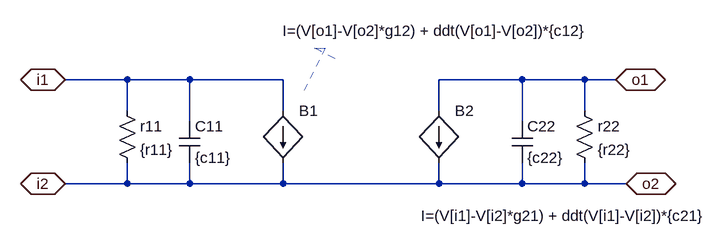
[diagram p0: schematic model_y.asc]
model_y.asc, the LTspice schematic file:
Version 4
SHEET 1 1028 680
WIRE -16 64 -112 64
WIRE 80 64 -16 64
WIRE 224 64 80 64
WIRE 592 64 464 64
WIRE 688 64 592 64
WIRE 736 64 688 64
WIRE -16 112 -16 64
WIRE 224 112 224 64
WIRE 464 112 464 64
WIRE 688 112 688 64
WIRE 80 128 80 64
WIRE 592 128 592 64
WIRE -16 224 -16 192
WIRE -16 224 -112 224
WIRE 80 224 80 192
WIRE 80 224 -16 224
WIRE 224 224 224 192
WIRE 224 224 80 224
WIRE 464 224 464 192
WIRE 464 224 224 224
WIRE 592 224 592 192
WIRE 592 224 464 224
WIRE 688 224 688 192
WIRE 688 224 592 224
WIRE 752 224 688 224
FLAG -112 64 i1
IOPIN -112 64 BiDir
FLAG -112 224 i2
IOPIN -112 224 BiDir
FLAG 736 64 o1
IOPIN 736 64 BiDir
FLAG 752 224 o2
IOPIN 752 224 BiDir
SYMBOL res -32 96 R0
SYMATTR InstName r11
SYMATTR Value {r11}
SYMBOL cap 64 128 R0
SYMATTR InstName C11
SYMATTR Value {c11}
SYMBOL res 672 96 R0
SYMATTR InstName r22
SYMATTR Value {r22}
SYMBOL cap 576 128 R0
SYMATTR InstName C22
SYMATTR Value {c22}
SYMBOL bi 224 112 R0
WINDOW 3 -1 -123 Left 2
SYMATTR InstName B1
SYMATTR Value I=(V[o1]-V[o2]*g12) + ddt(V[o1]-V[o2])*{c12}
SYMBOL bi 464 112 R0
WINDOW 3 -28 161 Left 2
SYMATTR InstName B2
SYMATTR Value I=(V[i1]-V[i2]*g21) + ddt(V[i1]-V[i2])*{c21}
LINE Normal 288 16 256 80 2
LINE Normal 272 16 288 16 2
LINE Normal 304 32 272 16 2

The netlist it stands for:
* model_y.asc
r11 i1 o2 {r11}
C11 i1 o2 {c11}
r22 o1 o2 {r22}
C22 o1 o2 {c22}
B1 i1 o2 I=(V[o1]-V[o2]*g12) + ddt(V[o1]-V[o2])*{c12}
B2 o1 o2 I=(V[i1]-V[i2]*g21) + ddt(V[i1]-V[i2])*{c21}
.backanno
.end